# EAGLE design gpio_unit (EAGLE 9.5.2)
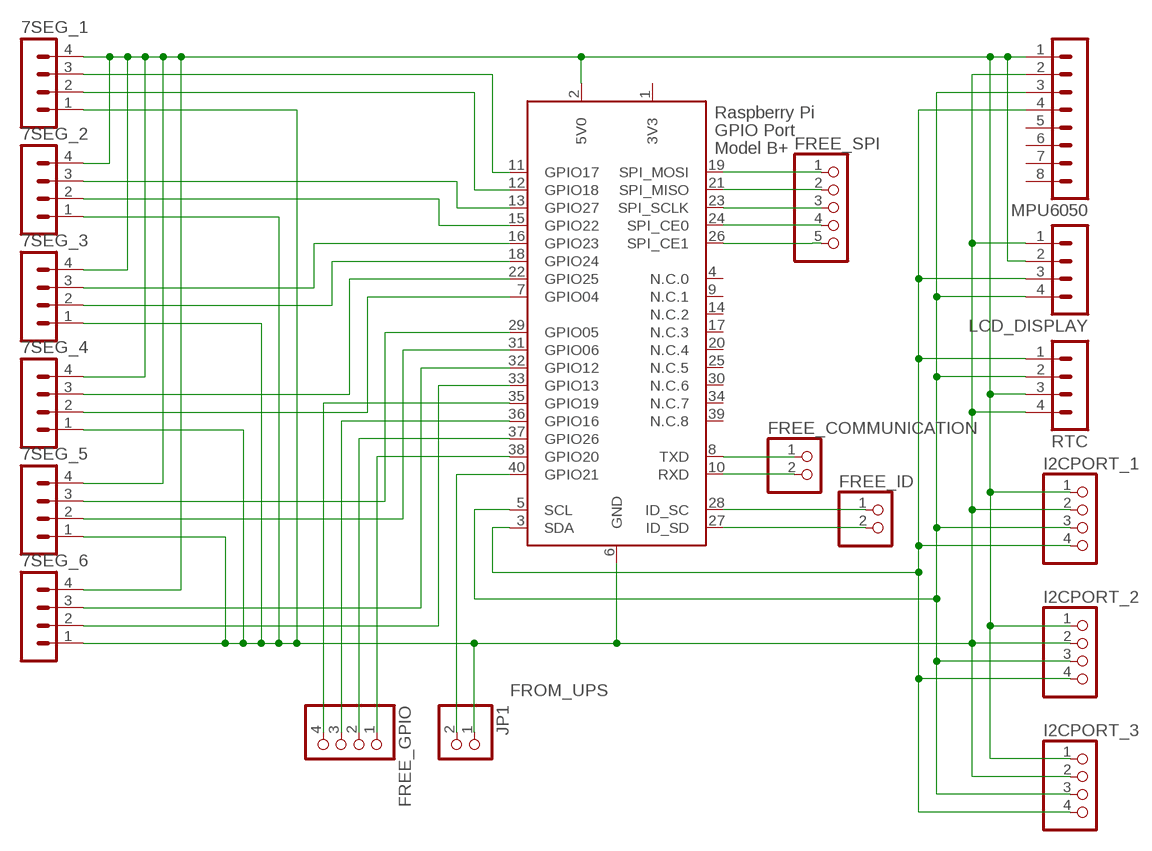
[diagram p0: schematic, sheet 1]

## Parts
7SEG_1  MA04-1  [MA04-1]
7SEG_2  MA04-1  [MA04-1]
7SEG_3  MA04-1  [MA04-1]
7SEG_4  MA04-1  [MA04-1]
7SEG_5  MA04-1  [MA04-1]
7SEG_6  MA04-1  [MA04-1]
FREE_COMMUNICATION  PINHD-1X2/90  [1X02/90]
FREE_GPIO  PINHD-1X4/90  [1X04/90]
FREE_ID  PINHD-1X2/90  [1X02/90]
FREE_SPI  PINHD-1X5/90  [1X05/90]
I2CPORT_1  PINHD-1X4  [1X04]
I2CPORT_2  PINHD-1X4  [1X04]
I2CPORT_3  PINHD-1X4  [1X04]
JP1  PINHD-1X2  [1X02]
LCD_DISPLAY  MA04-1  [MA04-1]
MPU6050  MA08-1  [MA08-1]
RTC  MA04-1  [MA04-1]
X1  RASPI_GPIO_B+_PIN  [RASPI_GPIO_B+_PIN]

## Nets
FROM_UPS: JP1.2 X1.40(GPIO21)
N$1: 7SEG_1.1 7SEG_2.1 7SEG_3.1 7SEG_4.1 7SEG_5.1 7SEG_6.1 I2CPORT_1.2 I2CPORT_2.2 I2CPORT_3.2 JP1.1 LCD_DISPLAY.1 MPU6050.2 RTC.4 X1.6(GND)
N$2: 7SEG_1.3 X1.11(GPIO17)
N$3: 7SEG_1.2 X1.12(GPIO18)
N$4: 7SEG_2.3 X1.13(GPIO27)
N$5: I2CPORT_1.3 I2CPORT_2.3 I2CPORT_3.3 LCD_DISPLAY.4 MPU6050.3 RTC.2 X1.5(SCL)
N$6: 7SEG_2.2 X1.15(GPIO22)
N$7: 7SEG_3.3 X1.16(GPIO23)
N$8: 7SEG_3.2 X1.18(GPIO24)
N$9: 7SEG_4.3 X1.22(GPIO25)
N$10: 7SEG_4.2 X1.7(GPIO04)
N$11: 7SEG_5.3 X1.29(GPIO05)
N$12: 7SEG_5.2 X1.31(GPIO06)
N$13: 7SEG_6.3 X1.32(GPIO12)
N$14: 7SEG_6.2 X1.33(GPIO13)
N$15: I2CPORT_1.4 I2CPORT_2.4 I2CPORT_3.4 LCD_DISPLAY.3 MPU6050.4 RTC.1 X1.3(SDA)
N$16: FREE_SPI.1 X1.19(SPI_MOSI)
N$17: FREE_SPI.2 X1.21(SPI_MISO)
N$18: FREE_SPI.3 X1.23(SPI_SCLK)
N$19: FREE_SPI.4 X1.24(SPI_CE0)
N$20: FREE_SPI.5 X1.26(SPI_CE1)
N$21: FREE_COMMUNICATION.1 X1.8(TXD)
N$22: FREE_COMMUNICATION.2 X1.10(RXD)
N$23: FREE_ID.1 X1.28(ID_SC)
N$24: FREE_ID.2 X1.27(ID_SD)
N$25: FREE_GPIO.4 X1.35(GPIO19)
N$26: FREE_GPIO.3 X1.36(GPIO16)
N$27: FREE_GPIO.2 X1.37(GPIO26)
N$28: FREE_GPIO.1 X1.38(GPIO20)
VDD: 7SEG_1.4 7SEG_2.4 7SEG_3.4 7SEG_4.4 7SEG_5.4 7SEG_6.4 I2CPORT_1.1 I2CPORT_2.1 I2CPORT_3.1 LCD_DISPLAY.2 MPU6050.1 RTC.3 X1.2(5V0)
Unconnected: MPU6050.5 MPU6050.6 MPU6050.7 MPU6050.8 X1.4(N.C.0) X1.9(N.C.1) X1.14(N.C.2) X1.17(N.C.3) X1.20(N.C.4) X1.25(N.C.5) X1.30(N.C.6) X1.34(N.C.7) X1.39(N.C.8)

## Power pins joined to a net without a drawn wire
3V3: X1.1(3V3)

## Library data of the parts
7SEG_1-7SEG_6 LCD_DISPLAY RTC = con-lstb:MA04-1: PIN HEADER; OC_FARNELL: unknown; OC_NEWARK: unknown
FREE_COMMUNICATION FREE_ID JP1 = pinhead:PINHD-1X2: PIN HEADER
FREE_GPIO I2CPORT_1-I2CPORT_3 = pinhead:PINHD-1X4: PIN HEADER
FREE_SPI = pinhead:PINHD-1X5: PIN HEADER
MPU6050 = con-lstb:MA08-1: PIN HEADER; OC_FARNELL: unknown; OC_NEWARK: unknown
X1 = raspberrypi_bastelstube_v13:RASPI_GPIO_B+: Only the 2x20 header connector, nothing else

## Net classes
0 default: width 0.6 mm, clearance 0.3 mm

## Board
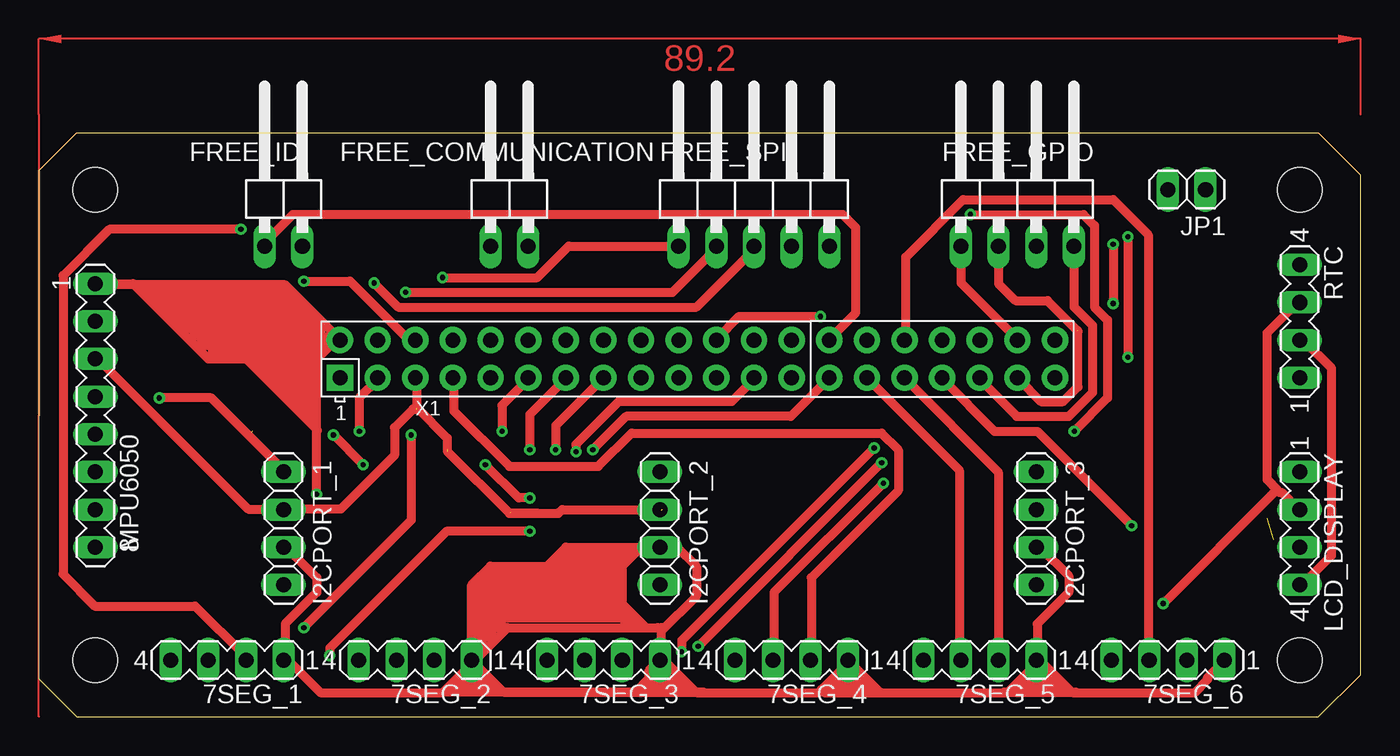
[diagram p1: board, top side]
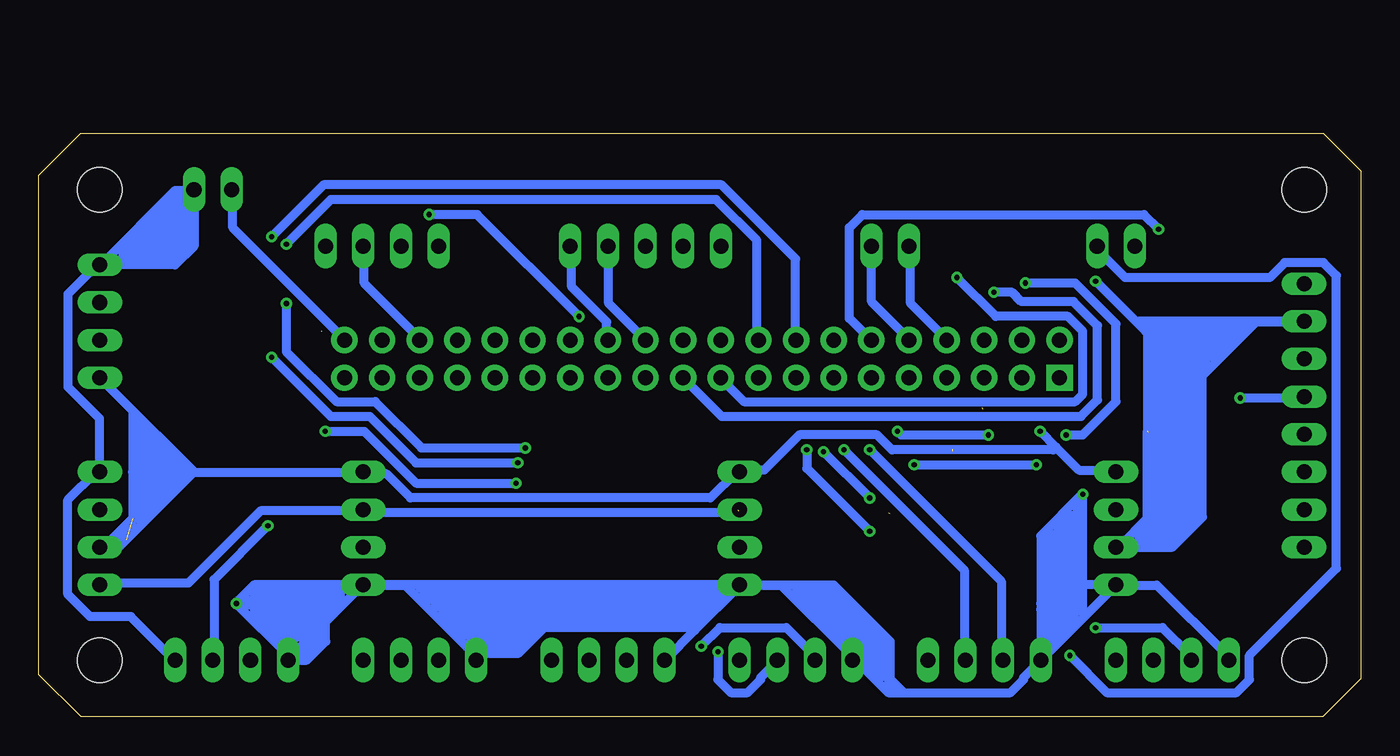
[diagram p2: board, bottom side, seen from below]

Size 89.2 x 39.36 mm. Coordinates in mm from the lower left corner, seen from the top.
Outline: 2.54,0 86.36,0 89.2,2.84 89.2,36.53 86.37,39.36 2.53,39.36 0,36.83 0,2.54 2.54,0
Copper layers (1*16): Top 0.035mm / dielectric 1.5mm / Bottom 0.035mm
Design rules "default": minimum track width 6mil, minimum drill 0.35mm, track to track 6mil, track to pad 6mil, pad to pad 6mil, via to via 6mil, smd to smd 6mil, copper to edge 40mil, drill to drill 6mil, minimum pad ring 10mil, minimum via ring 8mil, stop-mask expansion 4mil, vias tented up to drill 0mil, thermal gap 10mil
Holes 3 mm at 3.81,35.56 85.09,3.81 85.09,35.56 3.81,3.81

### Footprints (pad centres in the part's own frame; a part is rotated, then mirrored left to right if it is on the bottom)
MA04-1 = drill 1.016 long: 1 -3.81,0; 2 -1.27,0; 3 1.27,0; 4 3.81,0
1X02/90 = drill 1.016 long: 1 -1.27,-3.81; 2 1.27,-3.81
1X04/90 = drill 1.016 long: 1 -3.81,-3.81; 2 -1.27,-3.81; 3 1.27,-3.81; 4 3.81,-3.81
1X05/90 = drill 1.016 long: 1 -5.08,-3.81; 2 -2.54,-3.81; 3 0,-3.81; 4 2.54,-3.81; 5 5.08,-3.81
1X04 = drill 1.016 long: 1 -3.81,0; 2 -1.27,0; 3 1.27,0; 4 3.81,0
1X02 = drill 1.016 long: 1 -1.27,0; 2 1.27,0
MA08-1 = drill 1.016 long: 1 -8.89,0; 2 -6.35,0; 3 -3.81,0; 4 -1.27,0; 5 1.27,0; 6 3.81,0; 7 6.35,0; 8 8.89,0
RASPI_GPIO_B+_PIN = drill 1 pad 1.778 square: 1 -24.13,-1.27 | drill 1 pad 1.778: 2 -24.13,1.27; 3 -21.59,-1.27; 4 -21.59,1.27; 5 -19.05,-1.27; 6 -19.05,1.27; 7 -16.51,-1.27; 8 -16.51,1.27; 9 -13.97,-1.27; 10 -13.97,1.27; 11 -11.43,-1.27; 12 -11.43,1.27; 13 -8.89,-1.27; 14 -8.89,1.27; 15 -6.35,-1.27; 16 -6.35,1.27; 17 -3.81,-1.27; 18 -3.81,1.27; 19 -1.27,-1.27; 20 -1.27,1.27; 21 1.27,-1.27; 22 1.27,1.27; 23 3.81,-1.27; 24 3.81,1.27; 25 6.35,-1.27; 26 6.35,1.27; 27 8.89,-1.27; 28 8.89,1.27; 29 11.43,-1.27; 30 11.43,1.27; 31 13.97,-1.27; 32 13.97,1.27; 33 16.51,-1.27; 34 16.51,1.27; 35 19.05,-1.27; 36 19.05,1.27; 37 21.59,-1.27; 38 21.59,1.27; 39 24.13,-1.27; 40 24.13,1.27

### Placement (x,y rotation side)
7SEG_1  12.7,3.81 180 top
7SEG_2  25.4,3.81 180 top
7SEG_3  38.1,3.81 180 top
7SEG_4  50.8,3.81 180 top
7SEG_5  63.5,3.81 180 top
7SEG_6  76.2,3.81 180 top
FREE_COMMUNICATION  31.75,35.56 0 top
FREE_GPIO  66.04,35.56 0 top
FREE_ID  16.51,35.56 0 top
FREE_SPI  48.26,35.56 0 top
I2CPORT_1  16.51,12.7 90 top
I2CPORT_2  41.91,12.7 90 top
I2CPORT_3  67.31,12.7 90 top
JP1  77.47,35.56 180 top
LCD_DISPLAY  85.09,12.7 270 top
MPU6050  3.81,20.32 270 top
RTC  85.09,26.67 90 top
X1  44.45,24.13 0 top

### Tracks (layer width: path | path; a pad name or v marks a point on that pad's centre or on a via)
FROM_UPS
  Bottom 0.6: JP1.2 76.12,35.5 76.12,33 68.62,25.5 X1.40
N$1  (via drill 0.35)  (1 unrouted)
  Top 0.6: 7SEG_5.1 67.38,3.88 67.38,6.25 69.5,8.38 69.5,9.5 67.62,11.38 67.38,11.38 I2CPORT_3.2 | 7SEG_6.1 80,3.75 78.88,2.62 78.88,2.5 78,1.62 69.75,1.62 67.62,3.75 7SEG_5.1 | 7SEG_3.1 42,3.88 42,5.74 44.38,8.12 44.38,10.14 43.08,11.44 43.07,11.43 I2CPORT_2.2 | 52.81,1.81 52.62,1.62 44.38,1.62 42.25,3.75 7SEG_3.1 | 52.81,1.81 54.5,3.5 54.5,3.75 7SEG_4.1 56.77,1.65 | I2CPORT_1.2 16.62,11.5 18.75,9.38 18.75,8.38 16.62,6.25 16.62,3.88 7SEG_1.1 16.88,3.75 19,1.62 27.25,1.62 29.12,3.5 29.12,3.75 7SEG_2.1 | v17.88,29.38 21,29.38 24.88,25.5 25.38,25.5 X1.6 | 42,6 41.75,6 31.62,6 29.5,3.88 7SEG_2.1 | 7SEG_5.1 67.12,3.62 67.12,3.38 65.38,1.62 53,1.62 52.81,1.81 | 7SEG_2.1 29.21,8.89 30.48,10.16 34.29,10.16 35.56,11.43 I2CPORT_2.2 | I2CPORT_2.2 40.64,11.43 39.37,10.16 39.37,7.62 41.02,5.97 | 7SEG_2.1 31.37,1.65 40.26,1.65 | 40.26,1.65 44.83,1.65 40.26,1.65 | 40.26,1.65 27.3,1.65 | 7SEG_3.1 41.15,3.05 41.15,2.54 40.26,1.65
  Bottom 0.6: RTC.4 85.12,30.38 85.38,30.38 87.25,28.5 87.25,22.25 85.12,20.12 85.12,16.62 LCD_DISPLAY.1 85.38,16.5 87.25,14.62 87.25,8.25 85.75,6.75 83,6.75 80.12,3.88 7SEG_6.1 | RTC.4 84.88,30.62 80,35.5 78.75,35.5 JP1.1 78.74,31.75 80.01,30.48 RTC.4 | 11.08,22.58 14.38,19.29 14.38,13.38 16.25,11.5 16.5,11.5 I2CPORT_1.2 12.7,11.43 11.43,12.7 10.67,13.46 10.67,23.24 | 11.08,22.58 7.04,26.62 3.88,26.62 MPU6050.2 14.99,26.67 | v17.88,29.38 11.27,22.77 11.08,22.58 | 14.35,19.18 14.35,25.78
N$2  (via drill 0.35)
  Top 0.6: v17.88,6 25.12,13.25 v25.12,19 | v31.25,19.25 31.25,21 33,22.75 X1.11
  Bottom 0.6: v17.88,6 13.38,6 11.5,4.12 11.5,3.88 7SEG_1.3 | v25.12,19 31,19 v31.25,19.25
N$3  (via drill 0.35)
  Top 0.6: v13.62,32.88 4.75,32.88 1.62,29.75 1.62,9.61 3.77,7.46 10.54,7.46 13.88,4.12 13.88,3.88 7SEG_1.2
  Bottom 0.6: v13.62,32.88 14.62,33.88 33.62,33.88 34.5,33 34.5,26.88 33.12,25.5 X1.12
N$4  (via drill 0.35)
  Top 0.6: v33.12,18 33.12,20.38 35.5,22.75 X1.13
  Bottom 0.6: v33.12,18 24.25,9.12 24.25,3.88 7SEG_2.3
N$5  (4 unrouted)
  Top 0.6: RTC.2 85.12,25.38 85.38,25.38 87.25,23.5 87.25,10.88 85.38,9 85.12,9 LCD_DISPLAY.4 | MPU6050.3 3.88,24.25 14.12,14 16.5,14 I2CPORT_1.3 16.75,14 20.38,14 24,17.62 24,19.5 25.25,20.75 25.5,20.75 25.5,22.75 X1.5 | 31.88,13.75 33.62,13.75 | 41.88,13.88 I2CPORT_2.3 | 25.53,20.83 27.56,18.8 27.56,18.03 | 27.56,17.91 31.75,13.72 33.4,13.72 35.05,13.72 35.31,13.97 42.04,13.97
  Bottom 0.6: LCD_DISPLAY.4 85,9 79.12,9 74.25,13.88 67.38,13.88 I2CPORT_3.3 67.12,13.75 42.12,13.75 42,13.88 I2CPORT_2.3
N$6  (via drill 0.35)
  Top 0.6: v34.88,18 34.88,19.62 38,22.75 X1.15
  Bottom 0.6: v34.88,18 26.75,9.88 26.75,3.88 7SEG_2.2
N$7  (via drill 0.35)
  Top 0.6: v56.88,17.12 v44.5,4.75 | v73.5,32.38 v73.5,24.25
  Bottom 0.6: v44.5,4.75 43.25,6 38.75,6 36.88,4.12 36.88,3.88 7SEG_3.3 | v56.88,17.12 63.75,17.12 66.88,20.25 69.5,20.25 v73.5,24.25 | v73.5,32.38 70,35.88 43.12,35.88 38.12,30.88 38.12,25.5 X1.16
N$8  (via drill 0.35)
  Top 0.6: v43.38,4.38 43.38,5.12 v56.38,18.12 | v72.5,31.88 v72.5,27.88
  Bottom 0.6: v43.38,4.38 43.38,2.5 42.5,1.62 41.38,1.62 40.5,2.5 40.5,2.62 39.38,3.75 7SEG_3.2 | v56.38,18.12 63.38,18.12 66.5,21.25 69.12,21.25 72.5,24.62 v72.5,27.88 | v72.5,31.88 69.5,34.88 43.5,34.88 40.75,32.12 40.75,25.5 X1.18
N$9  (via drill 0.35)
  Top 0.6: v57,15.75 49.62,8.38 49.62,3.88 7SEG_4.3 | v69.88,19.25 72.12,21.5 72.12,26.75 71.25,27.62 71.25,33.12 70.5,33.88 v62.88,33.88 | v52.75,27 47.25,27 45.75,25.5 X1.22
  Bottom 0.6: v57,15.75 63.75,15.75 67.25,19.25 v69.88,19.25 | v62.88,33.88 59.62,33.88 v52.75,27
N$10
  Top 0.6: 7SEG_4.2 52.12,3.88 52.12,9.38 58,15.25 58,18 56.88,19.12 40,19.12 37.75,16.88 31.75,16.88 28,20.62 28,22.75 X1.7
N$11
  Top 0.6: 7SEG_5.3 62.12,3.88 62.12,16.62 56,22.75 X1.29
N$12
  Top 0.6: 7SEG_5.2 64.75,3.88 64.75,16.5 58.5,22.75 X1.31
N$13
  Top 0.6: 7SEG_6.3 74.88,3.88 74.88,32.5 72.5,34.88 62.38,34.88 58.5,31 58.5,25.5 X1.32
N$14  (via drill 0.35)
  Top 0.6: v73.75,12.88 67.38,19.25 64.5,19.25 61,22.75 X1.33
  Bottom 0.6: v73.75,12.88 77.38,9.25 77.38,3.88 7SEG_6.2
N$15  (via drill 0.35)  (1 unrouted)
  Top 0.6: v21.62,19.25 21.62,21.5 22.88,22.75 X1.3 | v8.12,21.5 11.62,21.5 16.5,16.62 I2CPORT_1.4
  Bottom 0.6: 82.88,16.5 82.88,20.62 85,22.75 RTC.1 | 82.88,16.5 82.88,13.38 84.75,11.5 85,11.5 LCD_DISPLAY.3 83.82,11.43 83.06,12.19 | 82.88,16.5 82.62,16.5 67.38,16.5 I2CPORT_3.4 67.12,16.38 65.75,16.38 64.12,14.75 43.88,14.75 42.12,16.5 I2CPORT_2.4 41.88,16.62 40.25,16.62 37.88,19 32.62,19 31.62,18 20.75,18 20.56,18.19 | v21.62,19.25 20.56,18.19 | 20.56,18.19 19,16.62 16.62,16.62 I2CPORT_1.4 | v8.12,21.5 3.88,21.5 MPU6050.4 | 83.06,12.19 78.74,16.51 83.82,21.59 | 83.06,12.19 83.31,11.94
N$16  (via drill 0.35)
  Top 0.6: FREE_SPI.1 35.75,31.75 33.62,29.62 v27.25,29.62
  Bottom 0.6: v27.25,29.62 24.62,27 19.75,27 18.75,26 18.75,21.75 19.25,21.25 41.62,21.25 43.12,22.75 X1.19
N$17  (via drill 0.35)
  Top 0.6: v24.75,28.62 42.75,28.62 45.62,31.5 45.62,31.75 FREE_SPI.2
  Bottom 0.6: v24.75,28.62 23.5,28.62 22.88,28 19.38,28 17.75,26.38 17.75,21.38 18.88,20.25 43.12,20.25 45.62,22.75 X1.21
N$18  (via drill 0.35)
  Top 0.6: v22.62,29.25 24.25,27.62 44.38,27.62 48.25,31.5 FREE_SPI.3 | v21.88,17 v19.88,19 | v30.12,17 32.38,14.75 v33.12,14.75 | v36.25,17.88 36.25,18.38 39.12,21.25 46.75,21.25 48.25,22.75 X1.23
  Bottom 0.6: v22.62,29.25 19.25,29.25 16.5,26.5 16.5,21.25 18.75,19 v19.88,19 | v30.12,17 v21.88,17 | v36.25,17.88 v33.12,14.75
N$19
  Bottom 0.6: FREE_SPI.4 50.75,31.75 50.75,27.88 48.38,25.5 X1.24
N$20
  Bottom 0.6: FREE_SPI.5 53.25,31.75 53.25,29 50.88,26.62 50.88,25.5 X1.26
N$21
  Bottom 0.6: FREE_COMMUNICATION.1 30.38,31.75 30.38,27.88 28,25.5 X1.8
N$22
  Bottom 0.6: FREE_COMMUNICATION.2 33,31.75 33,28 30.5,25.5 X1.10
N$23
  Top 0.6: FREE_ID.1 15.25,32 17.12,33.88 54.25,33.88 55.13,33 55.13,27.26 53.38,25.5 X1.28
N$24  (via drill 0.35)
  Top 0.6: v19.62,4.12 19.62,4.62 27.5,12.5 v33.12,12.5 | v37.38,18 39.62,20.25 50.75,20.25 53.25,22.75 X1.27
  Bottom 0.6: v19.62,4.12 17.12,1.62 8.38,1.62 7.5,2.5 7.5,4.12 1.62,10 1.62,29.75 2.5,30.62 5.12,30.62 6.12,29.62 15.88,29.62 17.75,31.5 17.75,31.75 FREE_ID.2 | v33.12,12.5 37.38,16.75 v37.38,18
N$25
  Top 0.6: FREE_GPIO.4 69.88,31.75 69.88,27.62 71.12,26.38 71.12,21.88 69.5,20.25 66,20.25 63.5,22.75 X1.35
N$26
  Bottom 0.6: FREE_GPIO.3 67.25,31.75 67.25,29.25 63.5,25.5 X1.36
N$27  (1 unrouted)
  Top 0.6: 64.88,31.25 64.88,31.75 FREE_GPIO.2 64.77,30.48 64.77,29.21 65.91,28.07 68.07,28.07 70.1,26.04 70.1,25.91 | 70.12,26 70.12,22.25 69.12,21.25 67.62,21.25 66.12,22.75 X1.37
N$28
  Top 0.6: FREE_GPIO.1 62.25,31.75 62.25,29.25 66,25.5 X1.38
N$29
  Top 0.6: 65.15,1.65 69.98,1.65
VDD  (via drill 0.35)
  Top 0.6: 83.56,15.31 82.88,16 82.88,25.88 85,28 RTC.3 | 83.56,15.31 83.75,15.12 83.88,15.12 85,14 LCD_DISPLAY.2 | v75.88,7.62 83.38,15.12 83.56,15.31 | v18.75,15 18.75,24.12 20,25.38 X1.2 20.25,25.5 16.62,29.12 3.88,29.12 MPU6050.1 6.35,29.21 11.43,24.13 13.97,24.13 18.8,19.3
  Bottom 0.6: I2CPORT_3.1 67.25,8.88 64.5,8.88 59.75,4.12 59.75,3.88 7SEG_5.4 59.5,4.25 56.88,4.25 55.12,6 45.12,6 44.94,5.81 | 7SEG_6.4 72.38,3.88 67.5,8.75 I2CPORT_3.1 | v75.88,7.62 72.38,4.12 7SEG_6.4 | 7SEG_1.4 9,3.88 9,4.12 13.75,8.88 16.5,8.88 I2CPORT_1.1 | 18.56,6.81 16.62,8.75 I2CPORT_1.1 | 18.56,6.81 21.5,3.88 7SEG_2.4 | I2CPORT_2.1 41.88,8.88 39.12,8.88 34.38,4.12 34.38,3.88 7SEG_3.4 34,3.75 31.88,1.62 23.62,1.62 22.75,2.5 22.75,2.62 21.75,3.62 7SEG_2.4 | 44.94,5.81 42,8.75 I2CPORT_2.1 | 44.94,5.81 46.88,3.88 7SEG_4.4 | v18.75,15 18.75,7 18.56,6.81 | I2CPORT_2.1 I2CPORT_3.1 | I2CPORT_3.1 73.66,8.89 74.68,8.89 75.95,7.62 | I2CPORT_2.1 35.56,8.89 31.75,5.08 31.75,2.54 30.86,1.65 | I2CPORT_1.1 20.32,8.89 21.59,7.62 21.59,7.24 | 21.59,7.24 7SEG_2.4 | 18.8,14.99 21.59,12.19 21.59,7.24 | 7SEG_6.4 71.12,3.81 69.85,5.08 69.85,6.73
(copper drawn outside any net)
  shapes: Bottom area x134, Top area x63

### Text on the board
Document: FROM UPS | GND | ID_SC | ID_SD | TXD | SPI_MOSI | SPI_MISO | SPI_SCLK | SPI_CE0 | SPI_CE1 | GPIO26 | GPIO26 | GPIO19 | GND | VDD | RXD | RXD | GPIO20 | GPIO16 | VDD | GND | SCL | SCL | SDA | SDA | SDA | SDA | SDA | GND | SCL | SCL | SCL | VDD | GND | GND | GND | SDA | VDD | VDD | VDD | SCL | VDD | GPIO17 | GPIO18 | VDD | GPIO27 | GPIO22 | VDD | GPIO24 | VDD | VDD | GPIO06 | VDD | GPIO12 | GND | GND | GPIO23 | GND | GPIO25 | GPIO04 | GPIO04 | GND | GPIO05 | GND | GPIO13 | GND